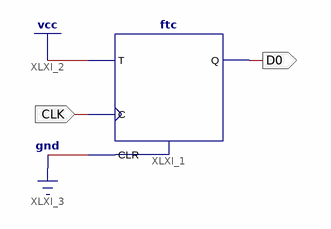
[diagram p0: schematic sheet 1]
// Xilinx ISE schematic main.sch (spartan6) as structural Verilog: 1 symbols, 2 ports
module main (
  input  CLK,
  output D0
);

  ftc XLXI_1 (.C(CLK), .CLR(1'b0), .T(1'b1), .Q(D0));
endmodule
